# EAGLE design PWM v1.1 (EAGLE 6.1)
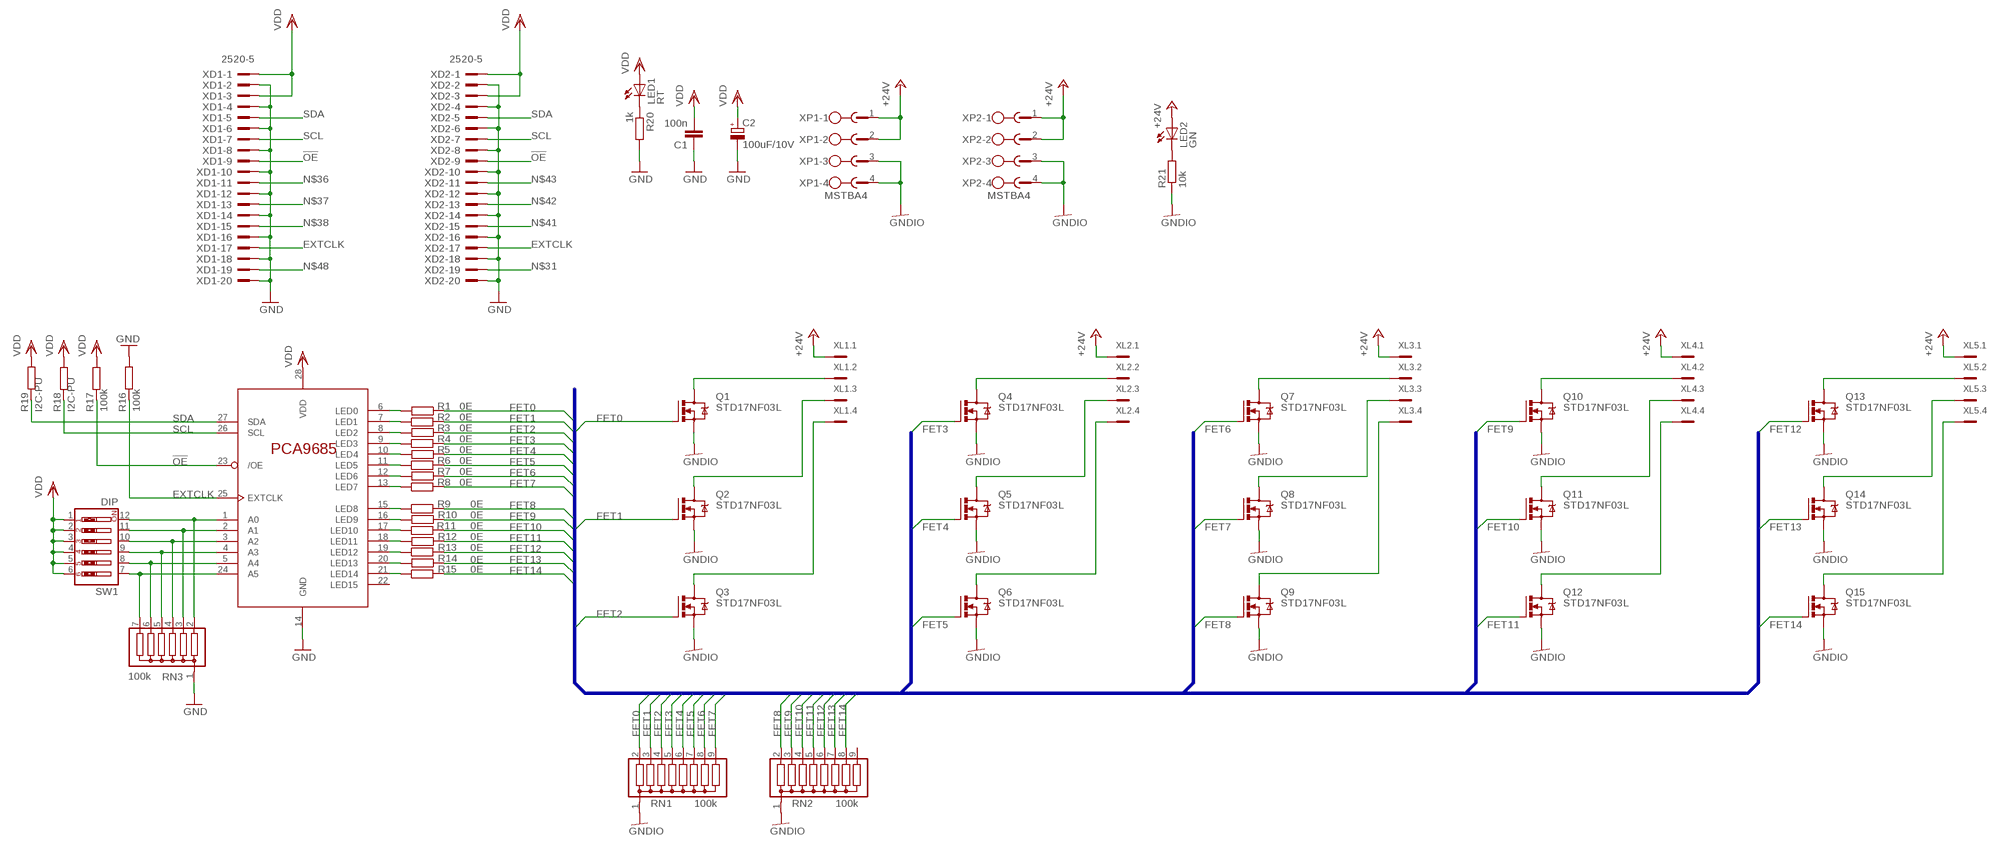
[diagram p0: schematic, sheet 1]

## Parts
C1  100n  C-EU025_050-035X075  [C025_050-035X075]
C2  100uF/10V  CPOL-EUE5-10.5  [E5-10,5]
IC1  PCA9685  [DIL28-6]
LED1  RT  LED3MM  [LED3MM]
LED2  GN  LED3MM  [LED3MM]
Q1  STD17NF03L  [TO251AA-V]
Q2  STD17NF03L  [TO251AA-V]
Q3  STD17NF03L  [TO251AA-V]
Q4  STD17NF03L  [TO251AA-V]
Q5  STD17NF03L  [TO251AA-V]
Q6  STD17NF03L  [TO251AA-V]
Q7  STD17NF03L  [TO251AA-V]
Q8  STD17NF03L  [TO251AA-V]
Q9  STD17NF03L  [TO251AA-V]
Q10  STD17NF03L  [TO251AA-V]
Q11  STD17NF03L  [TO251AA-V]
Q12  STD17NF03L  [TO251AA-V]
Q13  STD17NF03L  [TO251AA-V]
Q14  STD17NF03L  [TO251AA-V]
Q15  STD17NF03L  [TO251AA-V]
R1  0E  R-EU_0207/2V  [0207/2V]
R2  0E  R-EU_0207/2V  [0207/2V]
R3  0E  R-EU_0207/2V  [0207/2V]
R4  0E  R-EU_0207/2V  [0207/2V]
R5  0E  R-EU_0207/2V  [0207/2V]
R6  0E  R-EU_0207/2V  [0207/2V]
R7  0E  R-EU_0207/2V  [0207/2V]
R8  0E  R-EU_0207/2V  [0207/2V]
R9  0E  R-EU_0207/2V  [0207/2V]
R10  0E  R-EU_0207/2V  [0207/2V]
R11  0E  R-EU_0207/2V  [0207/2V]
R12  0E  R-EU_0207/2V  [0207/2V]
R13  0E  R-EU_0207/2V  [0207/2V]
R14  0E  R-EU_0207/2V  [0207/2V]
R15  0E  R-EU_0207/2V  [0207/2V]
R16  100k  R-EU_0207/2V  [0207/2V]
R17  100k  R-EU_0207/2V  [0207/2V]
R18  I2C-PU  R-EU_0207/2V  [0207/2V]
R19  I2C-PU  R-EU_0207/2V  [0207/2V]
R20  1k  R-EU_0207/2V  [0207/2V]
R21  10k  R-EU_0207/2V  [0207/2V]
RN1  100k  G08R  [SIL9]
RN2  100k  G08R  [SIL9]
RN3  100k  G06R  [SIL7]
SW1  DIP  SW_DIP-6  [EDG-06]
XD1  2520-5  [PAK100/2500-5-20]
XD2  2520-5  [PAK100/2500-5-20]
XL1  MC4  [MC4]
XL2  MC4  [MC4]
XL3  MC4  [MC4]
XL4  MC4  [MC4]
XL5  MC4  [MC4]
XP1  MSTBA4  [MSTBA4]
XP2  MSTBA4  [MSTBA4]

## Nets
!OE: IC1.23(/OE) R17.2 XD1.9 XD2.9
+24V: LED2.A XL1.1 XL2.1 XL3.1 XL4.1 XL5.1 XP1.1 XP1.2 XP2.1 XP2.2
EXTCLK: IC1.25(EXTCLK) R16.1 XD1.17 XD2.17
FET0: Q1.1(G) R1.1 RN1.9
FET1: Q2.1(G) R2.2 RN1.8
FET2: Q3.1(G) R3.1 RN1.7
FET3: Q4.1(G) R4.2 RN1.6
FET4: Q5.1(G) R5.1 RN1.5
FET5: Q6.1(G) R6.2 RN1.4
FET6: Q7.1(G) R7.1 RN1.3
FET7: Q8.1(G) R8.2 RN1.2
FET8: Q9.1(G) R9.2 RN2.2
FET9: Q10.1(G) R10.1 RN2.3
FET10: Q11.1(G) R11.2 RN2.4
FET11: Q12.1(G) R12.1 RN2.5
FET12: Q13.1(G) R13.2 RN2.6
FET13: Q14.1(G) R14.1 RN2.7
FET14: Q15.1(G) R15.2 RN2.8
GND: C1.1 C2.- IC1.14(GND) R16.2 R20.2 RN3.1 XD1.2 XD1.4 XD1.6 XD1.8 XD1.10 XD1.12 XD1.14 XD1.16 XD1.18 XD1.20 XD2.2 XD2.4 XD2.6 XD2.8 XD2.10 XD2.12 XD2.14 XD2.16 XD2.18 XD2.20
GNDIO: Q1.3(S) Q2.3(S) Q3.3(S) Q4.3(S) Q5.3(S) Q6.3(S) Q7.3(S) Q8.3(S) Q9.3(S) Q10.3(S) Q11.3(S) Q12.3(S) Q13.3(S) Q14.3(S) Q15.3(S) R21.1 RN1.1 RN2.1 XP1.3 XP1.4 XP2.3 XP2.4
N$1: Q1.2(D) XL1.2
N$2: Q2.2(D) XL1.3
N$3: Q3.2(D) XL1.4
N$4: Q6.2(D) XL2.4
N$5: Q4.2(D) XL2.2
N$6: Q5.2(D) XL2.3
N$7: Q8.2(D) XL3.3
N$8: Q7.2(D) XL3.2
N$9: Q9.2(D) XL3.4
N$10: Q10.2(D) XL4.2
N$11: Q11.2(D) XL4.3
N$12: Q12.2(D) XL4.4
N$13: Q13.2(D) XL5.2
N$14: Q14.2(D) XL5.3
N$15: Q15.2(D) XL5.4
N$16: IC1.6(LED0) R1.2
N$17: IC1.7(LED1) R2.1
N$18: IC1.8(LED2) R3.2
N$19: IC1.9(LED3) R4.1
N$20: IC1.10(LED4) R5.2
N$21: IC1.11(LED5) R6.1
N$22: IC1.12(LED6) R7.2
N$23: IC1.13(LED7) R8.1
N$24: IC1.15(LED8) R9.1
N$25: IC1.16(LED9) R10.2
N$26: IC1.17(LED10) R11.1
N$27: IC1.18(LED11) R12.2
N$28: IC1.19(LED12) R13.1
N$29: IC1.20(LED13) R14.2
N$30: IC1.21(LED14) R15.1
N$31: XD2.19
N$32: IC1.1(A0) RN3.2 SW1.12
N$33: IC1.2(A1) RN3.3 SW1.11
N$34: IC1.3(A2) RN3.4 SW1.10
N$36: XD1.11
N$37: XD1.13
N$38: XD1.15
N$39: IC1.4(A3) RN3.5 SW1.9
N$40: IC1.5(A4) RN3.6 SW1.8
N$41: XD2.15
N$42: XD2.13
N$43: XD2.11
N$45: IC1.24(A5) RN3.7 SW1.7
N$46: LED1.K(C) R20.1
N$47: LED2.K(C) R21.2
N$48: XD1.19
SCL: IC1.26(SCL) R18.2 XD1.7 XD2.7
SDA: IC1.27(SDA) R19.1 XD1.5 XD2.5
VDD: C1.2 C2.+ IC1.28(VDD) LED1.A R17.1 R18.1 R19.2 SW1.1 SW1.2 SW1.3 SW1.4 SW1.5 SW1.6 XD1.1 XD1.3 XD2.1 XD2.3
Unconnected: IC1.22(LED15) RN2.9

## Buses
FET[0..14]

## Library data of the parts
C1 = rcl:C-EU: CAPACITOR, European symbol
C2 = rcl:CPOL-EU: POLARIZED CAPACITOR, European symbol
IC1 = i2c-led-controller:PCA9685
LED1 LED2 = led:LED: LED OSRAM: - CHIPLED LG R971, LG N971, LY N971, LG Q971, LY Q971, LO R971, LY R971 LH N974, LH R974 LS Q976, LO Q976, LY Q976 LO Q996 - Hyper CHIPLED LW Q18S LB Q993, LB Q99A, LB R99A - SideLED LS A670, LO A670, LY A670, LG A670, LP A670 LB A673, LV A673, LT A673, LW A673 LH A674 LY A675 LS A676, LA A676, LO A676, LY A676, LW A676 LS A679, LY A679, LG A679 - Hyper Micro SIDELED® LS Y876, LA Y876, LO Y876, LY Y876 LT Y87S - SmartLED LW L88C, LW L88S LB L89C, LB L89S, LG L890 LS L89K, LO L89K, LY L89K LS L896, LA L896, LO L896, LY L896 - TOPLED LS T670, LO T670, LY T670, LG T670, LP T670 LSG T670, LSP T670, LSY T670, LOP T670, LYG T670 LG T671, LOG T671, LSG T671 LB T673, LV T673, LT T673, LW T673 LH T674 LS T676, LA T676, LO T676, LY T676, LB T676, LH T676, LSB T676, LW T676 LB T67C, LV T67C, LT T67C, LS T67K, LO T67K, LY T67K, LW E67C LS E67B, LA E67B, LO E67B, LY E67B, LB E67C, LV E67C, LT E67C LW T67C LS T679, LY T679, LG T679 LS T770, LO T770, LY T770, LG T770, LP T770 LB T773, LV T773, LT T773, LW T773 LH T774 LS E675, LA E675, LY E675, LS T675 LS T776, LA T776, LO T776, LY T776, LB T776 LHGB T686 LT T68C, LB T68C - Hyper Mini TOPLED® LB M676 - Mini TOPLED Santana® LG M470 LS M47K, LO M47K, LY M47K Source: http://www.osram.convergy.de LUXEON: - LUMILED® LXK2-PW12-R00, LXK2-PW12-S00, LXK2-PW14-U00, LXK2-PW14-V00 LXK2-PM12-R00, LXK2-PM12-S00, LXK2-PM14-U00 LXK2-PE12-Q00, LXK2-PE12-R00, LXK2-PE12-S00, LXK2-PE14-T00, LXK2-PE14-U00 LXK2-PB12-K00, LXK2-PB12-L00, LXK2-PB12-M00, LXK2-PB14-N00, LXK2-PB14-P00, LXK2-PB14-Q00 LXK2-PR12-L00, LXK2-PR12-M00, LXK2-PR14-Q00, LXK2-PR14-R00 LXK2-PD12-Q00, LXK2-PD12-R00, LXK2-PD12-S00 LXK2-PH12-R00, LXK2-PH12-S00 LXK2-PL12-P00, LXK2-PL12-Q00, LXK2-PL12-R00 Source: www.luxeon.com KINGBRIGHT: KA-3528ASYC Source: www.kingbright.com
Q1-Q15 = STD17NF03L:STD17NF03L: STD17NF03L http://www.st.com/internet/com/TECHNICAL_RESOURCES/TECHNICAL_LITERATURE/DATASHEET/CD00002145.pdf
R1-R21 = resistor:R-EU_: RESISTOR, European symbol
RN1 RN2 = resistor-sil:G08R: SIL RESISTOR; OC_FARNELL: unknown; OC_NEWARK: unknown
RN3 = resistor-sil:G06R: SIL RESISTOR; OC_FARNELL: unknown; OC_NEWARK: unknown
SW1 = special:SW_DIP-6: DIP SWITCH
XD1 XD2 = con-3m:2520-: 3M (TM) Pak 100 4-Wall Header Source: 3M; MPN: D2520-5002-AR; OC_FARNELL: unknown; OC_NEWARK: 12P7058
XL1-XL5 = con-phoenix-381_l_1:MC4: Mini-Combicon 3.81mm horizontal 4-polig MC 1,5/4-G-3,81 Artikel-Nr. 1803293
XP1 XP2 = con-phoenix-508:MSTBA4: PHOENIX; MF: FARNELL; MPN: 1757268; OC_FARNELL: 3705195; OC_NEWARK: 71C4163

## Net classes
0 default: width 0.254 mm

## Board
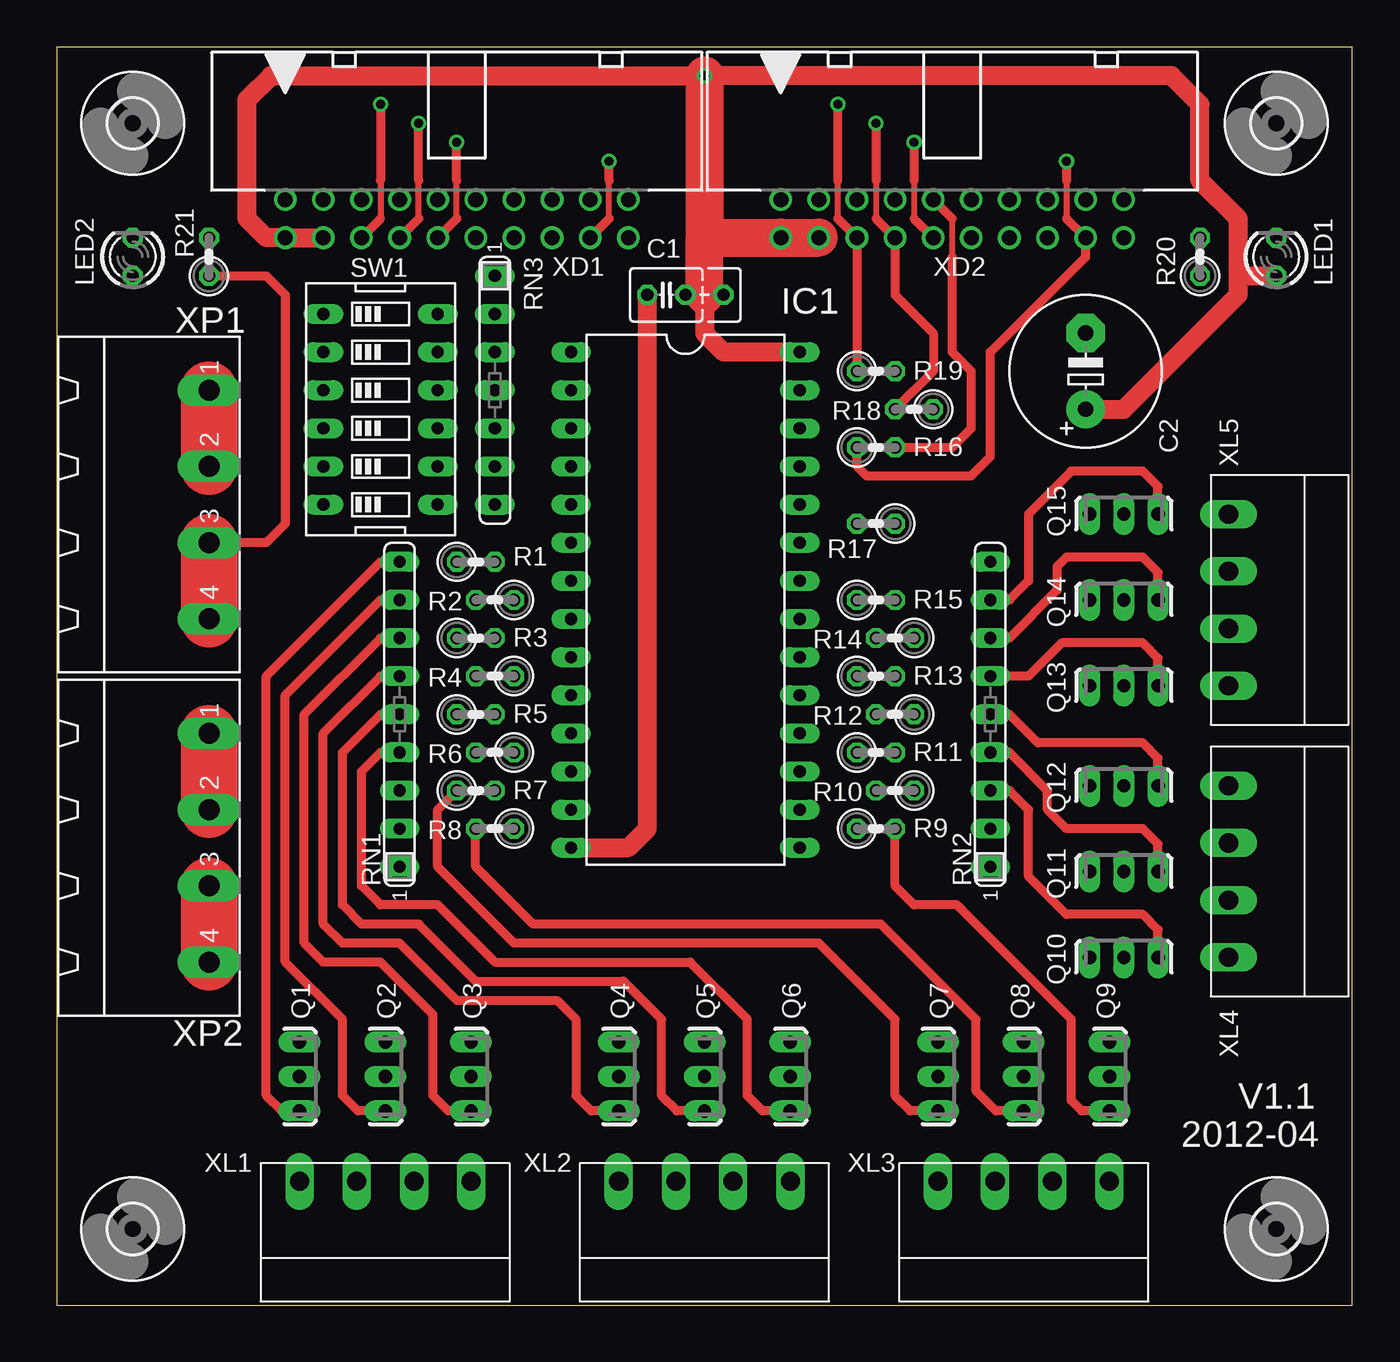
[diagram p1: board, top side]
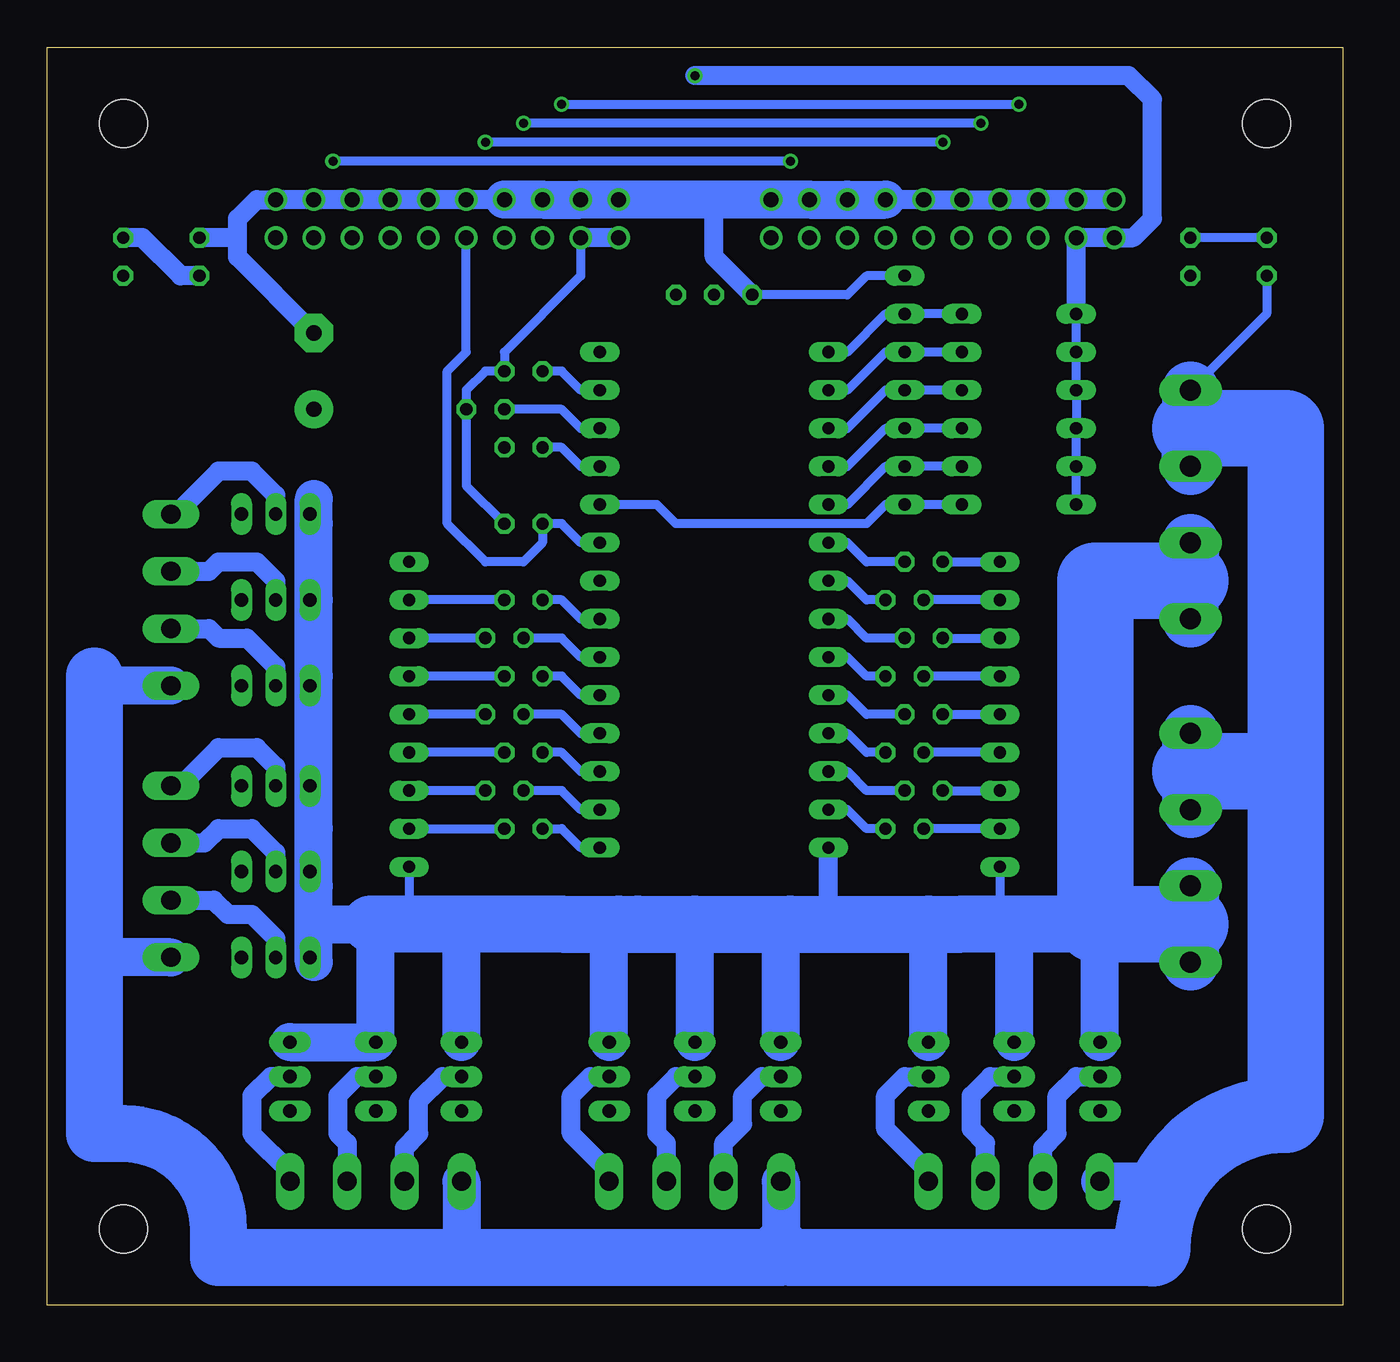
[diagram p2: board, bottom side, seen from below]

Size 86.35 x 83.81 mm. Coordinates in mm from the lower left corner, seen from the top.
Outline: 0,0 86.35,0 86.35,83.81 0,83.81 0,0
Copper layers (1*16): Top 0.035mm / dielectric 1.6mm / Bottom 0.035mm
Design rules: minimum track width 8mil, minimum drill 16mil, track to track 8mil, track to pad 10mil, pad to pad 10mil, via to via 8mil, smd to smd 8mil, copper to edge 40mil, drill to drill 8mil, minimum pad ring 10mil, minimum via ring 8mil, stop-mask expansion 4mil, vias tented up to drill 0mil, thermal gap 10mil

### Footprints (pad centres in the part's own frame; a part is rotated, then mirrored left to right if it is on the bottom)
C025_050-035X075 = drill 0.813 octagon: 1 -1.27,0; 2 1.27,0; 3 3.81,0
E5-10,5 = drill 1.016 pad 2.54: + -2.54,0 | drill 1.016 pad 2.54 octagon: - 2.54,0
DIL28-6 = drill 0.813 long: 1 -15.24,-7.62; 2 -12.7,-7.62; 3 -10.16,-7.62; 4 -7.62,-7.62; 5 -5.08,-7.62; 6 -2.54,-7.62; 7 0,-7.62; 8 2.54,-7.62; 9 5.08,-7.62; 10 7.62,-7.62; 11 10.16,-7.62; 12 12.7,-7.62; 13 15.24,-7.62; 14 17.78,-7.62; 15 17.78,7.62; 16 15.24,7.62; 17 12.7,7.62; 18 10.16,7.62; 19 7.62,7.62; 20 5.08,7.62; 21 2.54,7.62; 22 0,7.62; 23 -2.54,7.62; 24 -5.08,7.62; 25 -7.62,7.62; 26 -10.16,7.62; 27 -12.7,7.62; 28 -15.24,7.62
LED3MM = drill 0.813 octagon: A -1.27,0; K 1.27,0
TO251AA-V = drill 0.889 long: 1 -2.286,0; 2 0,0; 3 2.286,0
0207/2V = drill 0.813 octagon: 1 -1.27,0; 2 1.27,0
SIL9 = drill 0.813 long: 1 -10.16,0; 2 -7.62,0; 3 -5.08,0; 4 -2.54,0; 5 0,0; 6 2.54,0; 7 5.08,0; 8 7.62,0; 9 10.16,0
SIL7 = drill 0.813 long: 1 -7.62,0; 2 -5.08,0; 3 -2.54,0; 4 0,0; 5 2.54,0; 6 5.08,0; 7 7.62,0
EDG-06 = drill 0.813 long: 1 -6.35,-3.81; 2 -3.81,-3.81; 3 -1.27,-3.81; 4 1.27,-3.81; 5 3.81,-3.81; 6 6.35,-3.81; 7 6.35,3.81; 8 3.81,3.81; 9 1.27,3.81; 10 -1.27,3.81; 11 -3.81,3.81; 12 -6.35,3.81
3,2 = hole 3.2: 0,0
PAK100/2500-5-20 = drill 1 pad 1.422: 1 -11.43,-1.27; 2 -11.43,1.27; 3 -8.89,-1.27; 4 -8.89,1.27; 5 -6.35,-1.27; 6 -6.35,1.27; 7 -3.81,-1.27; 8 -3.81,1.27; 9 -1.27,-1.27; 10 -1.27,1.27; 11 1.27,-1.27; 12 1.27,1.27; 13 3.81,-1.27; 14 3.81,1.27; 15 6.35,-1.27; 16 6.35,1.27; 17 8.89,-1.27; 18 8.89,1.27; 19 11.43,-1.27; 20 11.43,1.27
MC4 = drill 1.27 long: 1 -5.715,0; 2 -1.905,0; 3 1.905,0; 4 5.715,0
MSTBA4 = drill 1.397 long: 1 -7.62,5.08; 2 -2.54,5.08; 3 2.54,5.08; 4 7.62,5.08

### Placement (x,y rotation side)
C1  40.64,67.31 0 top
C2  68.58,62.23 90 top
IC1  41.91,48.26 270 top
LED1  81.28,69.85 90 top
LED2  5.08,69.85 90 top
Q1  16.19,15.24 90 top
Q2  21.91,15.24 90 top
Q3  27.62,15.24 90 top
Q4  37.47,15.24 90 top
Q5  43.18,15.24 90 top
Q6  48.9,15.24 90 top
Q7  58.74,15.24 90 top
Q8  64.45,15.24 90 top
Q9  70.17,15.24 90 top
Q10  71.12,23.18 180 top
Q11  71.12,28.89 180 top
Q12  71.12,34.61 180 top
Q13  71.12,41.27 180 top
Q14  71.12,46.99 180 top
Q15  71.12,52.7 180 top
R1  27.94,49.53 0 top
R2  29.21,46.99 180 top
R3  27.94,44.45 0 top
R4  29.21,41.91 180 top
R5  27.94,39.37 0 top
R6  29.21,36.83 180 top
R7  27.94,34.29 0 top
R8  29.21,31.75 180 top
R9  54.61,31.75 0 top
R10  55.88,34.29 180 top
R11  54.61,36.83 0 top
R12  55.88,39.37 180 top
R13  54.61,41.91 0 top
R14  55.88,44.45 180 top
R15  54.61,46.99 0 top
R16  54.61,57.15 0 top
R17  54.61,52.07 180 top
R18  57.15,59.69 180 top
R19  54.61,62.23 0 top
R20  76.2,69.85 90 top
R21  10.16,69.85 90 top
RN1  22.86,39.37 90 top
RN2  62.23,39.37 90 top
RN3  29.21,60.96 270 top
SW1  21.59,59.69 270 top
U$1  [3,2]  5.08,78.74 0 top
U$2  [3,2]  5.08,5.08 0 top
U$3  [3,2]  81.28,5.08 0 top
U$4  [3,2]  81.28,78.74 0 top
XD1  26.67,72.39 0 top
XD2  59.69,72.39 0 top
XL1  21.91,8.26 0 top
XL2  43.18,8.26 0 top
XL3  64.45,8.26 0 top
XL4  78.11,28.89 90 top
XL5  78.11,46.99 90 top
XP1  5.08,53.34 270 top
XP2  5.08,30.48 270 top

### Tracks (layer width: path | path; a pad name or v marks a point on that pad's centre or on a via)
!OE  (via drill 0.6)
  Top 0.406: 26.67,72.39 26.67,74.93 | 57.15,74.93 57.15,72.39
  Top 0.61: XD1.9 26.67,72.39 | 26.67,74.93 v26.67,77.47 | v57.15,77.47 57.15,74.93 | 57.15,72.39 XD2.9
  Bottom 0.61: IC1.23 50.8,50.8 52.07,52.07 R17.2 53.34,50.8 54.61,49.53 57.15,49.53 59.69,52.07 59.69,62.23 58.42,63.5 XD2.9 | v26.67,77.47 v57.15,77.47
+24V
  Top 3.81: XP1.1 XP1.2 | XP2.1 XP2.2
  Bottom 0.61: LED2.A 5.08,66.04 XP1.1
  Bottom 2.54: 58.42,2.54 58.74,2.86 58.42,3.17 | XL3.1 58.74,3.17 | XL2.1 37.47,3.81 37.47,3.17 | XL5.1 83.19,41.27 83.19,41.91 | XL4.1 83.19,23.18 | XL1.1 12.06,8.26 | 12.06,8.26 11.43,8.89 | 12.7,3.17 12.7,3.81 12.06,4.45 12.06,8.26
  Bottom 3.81: XP1.1 10.16,58.42 XP1.2 | XP2.1 10.16,35.56 XP2.2 | 37.47,3.17 58.42,3.17 58.74,3.17 74.93,3.17 74.93,5.08 arc-90 81.28,11.43 83.19,11.43 83.19,23.18 83.19,41.91 | 12.7,3.17 36.83,3.17 37.47,3.81
  Bottom 5.08: 10.16,58.42 3.81,58.42 3.81,35.56 | 3.81,35.56 3.81,12.7 arc-90 12.7,3.81 | 10.16,35.56 3.81,35.56
EXTCLK  (via drill 0.6)
  Top 0.406: 36.83,72.39 36.83,74.93 | 67.31,74.93 67.31,72.39
  Top 0.61: R16.1 53.34,55.88 53.98,55.24 60.96,55.24 62.23,56.52 62.23,63.5 68.58,69.85 XD2.17 67.31,72.39 | 36.83,74.93 v36.83,76.2 | XD1.17 36.83,72.39 | v67.31,76.2 67.31,74.93
  Bottom 0.61: IC1.25 50.8,55.88 52.07,57.15 R16.1 | v36.83,76.2 v67.31,76.2
FET0
  Top 0.61: RN1.9 21.59,49.53 13.97,41.91 13.97,13.97 14.99,12.95 Q1.1
  Bottom 0.61: R1.1 RN1.9
FET1
  Top 0.61: RN1.8 21.59,46.99 15.24,40.64 15.24,22.86 19.05,19.05 19.05,13.97 20.07,12.95 Q2.1
  Bottom 0.61: RN1.8 R2.2
FET2
  Top 0.61: RN1.7 21.59,44.45 16.51,39.37 16.51,24.13 17.78,22.86 21.59,22.86 25.08,19.37 25.08,13.97 26.1,12.95 Q3.1
  Bottom 0.61: R3.1 RN1.7
FET3
  Top 0.61: Q4.1 35.62,12.95 34.61,13.97 34.61,19.05 33.34,20.32 26.67,20.32 22.86,24.13 19.05,24.13 17.78,25.4 17.78,38.1 21.59,41.91 RN1.6
  Bottom 0.61: RN1.6 R4.2
FET4
  Top 0.61: RN1.5 21.59,39.37 19.05,36.83 19.05,26.67 20.32,25.4 24.13,25.4 27.94,21.59 37.78,21.59 40.32,19.05 40.32,13.97 41.34,12.95 Q5.1
  Bottom 0.61: R5.1 RN1.5
FET5
  Top 0.61: RN1.4 21.59,36.83 20.32,35.56 20.32,27.94 21.59,26.67 25.4,26.67 29.21,22.86 42.23,22.86 46.04,19.05 46.04,13.97 47.05,12.95 Q6.1
  Bottom 0.61: RN1.4 R6.2
FET6
  Top 0.61: R7.1 25.4,33.02 25.4,29.21 30.48,24.13 50.8,24.13 55.88,19.05 55.88,13.97 56.9,12.95 Q7.1
  Bottom 0.61: R7.1 RN1.3
FET7
  Top 0.61: R8.2 27.94,29.21 31.75,25.4 54.93,25.4 61.28,19.05 61.28,14.29 62.61,12.95 Q8.1
  Bottom 0.61: RN1.2 R8.2
FET8
  Top 0.61: R9.2 55.88,27.94 57.15,26.67 60.01,26.67 67.63,19.05 67.63,13.65 68.33,12.95 Q9.1
  Bottom 0.61: RN2.2 R9.2
FET9
  Top 0.61: Q10.1 73.41,25.02 72.39,26.04 67.31,26.04 64.77,28.57 64.77,33.02 63.5,34.29 RN2.3
  Bottom 0.61: R10.1 RN2.3
FET10
  Top 0.61: Q11.1 73.41,30.73 72.39,31.75 67.31,31.75 66.04,33.02 66.04,34.29 63.5,36.83 RN2.4
  Bottom 0.61: R11.2 RN2.4
FET11
  Top 0.61: Q12.1 73.41,36.45 72.39,37.47 65.41,37.47 63.5,39.37 RN2.5
  Bottom 0.61: R12.1 RN2.5
FET12
  Top 0.61: Q13.1 73.41,43.12 72.39,44.13 66.99,44.13 64.77,41.91 RN2.6
  Bottom 0.61: R13.2 RN2.6
FET13
  Top 0.61: Q14.1 73.41,48.83 72.39,49.85 67.31,49.85 66.67,49.21 66.67,47.62 63.5,44.45 RN2.7
  Bottom 0.61: R14.1 RN2.7
FET14
  Top 0.61: Q15.1 73.41,54.55 72.39,55.56 67.63,55.56 64.77,52.7 64.77,48.26 63.5,46.99 RN2.8
  Bottom 0.61: R15.2 RN2.8
GND
  Top 0.406: 59.69,69.85 59.69,72.39
  Top 0.61: R16.2 59.69,57.15 60.96,58.42 60.96,62.23 59.69,63.5 59.69,69.85 | 59.69,72.39 XD2.10
  Top 1.27: IC1.14 38.1,30.48 39.37,31.75 C1.1
  Bottom 0.61: RN3.1 31.75,68.58 33.02,67.31 C1.1
  Bottom 1.27: XD1.14 XD1.12 XD1.10 XD1.8 XD1.6 XD1.4 XD1.2 | XD2.8 XD2.10 XD2.12 XD2.14 XD2.16 XD2.18 XD2.20 72.39,73.66 73.66,72.39 73.66,71.12 | 73.66,71.12 R20.2 | C1.1 41.91,69.85 41.91,73.66 | C2.- 73.66,69.85 73.66,71.12 | 34.29,25.4 IC1.14
  Bottom 2.54: XD1.14 XD1.16 XD1.18 XD1.20 41.91,73.66 XD2.2 XD2.4 XD2.6 XD2.8
GNDIO
  Top 0.61: R21.1 13.97,68.58 15.24,67.31 15.24,52.07 13.97,50.8 XP1.3
  Top 3.81: XP1.3 XP1.4 | XP2.3 XP2.4
  Bottom 0.61: RN1.1 22.86,25.4 | RN2.1 62.23,25.4
  Bottom 1.27: 20.07,25.15 20.32,25.4 | 24.51,24.51 25.4,25.4 | 47.37,25.4 46.99,25.4 | Q12.3 68.83,31.75 68.58,31.75 | Q11.3 68.83,27.94 68.58,27.94 | Q13.3 68.83,41.91 68.58,41.91 | Q14.3 68.58,46.99 | Q15.3 68.83,52.07 68.58,52.07 | Q10.3 68.83,22.86 68.58,22.86
  Bottom 2.54: 68.58,25.4 68.58,27.94 68.58,31.75 68.58,41.91 68.58,46.99 68.58,52.07 68.58,53.72 | 68.58,22.86 68.58,25.4 | 68.58,25.4 64.77,25.4 | 52.45,25.34 52.13,25.34 52.07,25.4 | Q4.3 37.47,24.77 36.83,25.4 | Q1.3 16.19,25.08 16.51,25.4 | Q2.3 21.91,25.08 21.59,25.4 | Q3.3 27.62,25.4 | Q5.3 43.18,25.4 | Q6.3 48.9,24.77 48.26,25.4 | 63.5,25.4 64.45,25.4 Q8.3 Q9.3 | Q7.3 58.74,25.4
  Bottom 3.81: 16.51,25.4 20.32,25.4 21.59,25.4 22.86,25.4 25.4,25.4 27.62,25.4 36.83,25.4 43.18,25.4 46.99,25.4 48.26,25.4 52.07,25.4 58.74,25.4 62.23,25.4 64.45,25.4 64.77,25.4 | XP1.3 10.16,48.26 XP1.4 | XP2.3 10.16,25.4 XP2.4
  Bottom 5.08: 10.16,48.26 16.51,48.26 16.51,25.4 10.16,25.4
N$1
  Bottom 1.27: XL1.2 20,10.48 19.05,11.43 19.05,13.97 17.78,15.24 Q1.2
N$2
  Bottom 1.27: XL1.3 23.81,10.79 24.77,11.75 24.77,13.97 23.5,15.24 Q2.2
N$3
  Bottom 1.27: XL1.4 27.62,8.89 30.48,11.75 30.48,13.97 29.21,15.24 Q3.2
N$4
  Bottom 1.27: XL2.4 48.9,8.89 51.44,11.43 51.44,13.97 50.16,15.24 Q6.2
N$5
  Bottom 1.27: XL2.2 41.27,10.79 40.01,12.06 40.01,13.97 38.73,15.24 Q4.2
N$6
  Bottom 1.27: XL2.3 45.09,10.79 45.72,11.43 45.72,13.97 44.45,15.24 Q5.2
N$7
  Bottom 1.27: Q8.2 65.72,15.24 66.99,13.97 66.99,11.43 66.36,10.79 XL3.3
N$8
  Bottom 1.27: XL3.2 62.55,10.48 61.59,11.43 61.59,13.65 60.01,15.24 Q7.2 58.42,15.24
N$9
  Bottom 1.27: Q9.2 71.44,15.24 72.71,13.97 72.71,11.43 70.17,8.89 XL3.4
N$10
  Bottom 1.27: XL4.2 75.25,26.99 74.3,26.04 72.71,26.04 71.12,24.45 Q10.2 71.12,22.86
N$11
  Bottom 1.27: XL4.3 75.88,30.8 74.93,31.75 72.71,31.75 71.12,30.16 Q11.2
N$12
  Bottom 1.27: XL4.4 77.47,34.61 74.93,37.15 72.39,37.15 71.12,35.88 Q12.2
N$13
  Bottom 1.27: XL5.2 75.56,45.09 74.93,44.45 73.03,44.45 71.12,42.55 Q13.2
N$14
  Bottom 1.27: XL5.3 75.56,48.9 74.93,49.53 72.39,49.53 71.12,48.26 Q14.2
N$15
  Bottom 1.27: Q15.2 71.12,53.98 72.71,55.56 74.93,55.56 77.79,52.7 XL5.4
N$16
  Bottom 0.61: R1.2 31.75,49.53 33.02,50.8 IC1.6
N$17
  Bottom 0.61: R2.1 31.75,46.99 33.02,48.26 IC1.7
N$18
  Bottom 0.61: R3.2 31.75,44.45 33.02,45.72 IC1.8
N$19
  Bottom 0.61: R4.1 31.75,41.91 33.02,43.18 IC1.9
N$20
  Bottom 0.61: R5.2 31.75,39.37 33.02,40.64 IC1.10
N$21
  Bottom 0.61: R6.1 31.75,36.83 33.02,38.1 IC1.11
N$22
  Bottom 0.61: R7.2 31.75,34.29 33.02,35.56 IC1.12
N$23
  Bottom 0.61: R8.1 31.75,31.75 33.02,33.02 IC1.13
N$24
  Bottom 0.61: R9.1 52.07,31.75 50.8,30.48 IC1.15
N$25
  Bottom 0.61: IC1.16 50.8,33.02 52.07,34.29 R10.2
N$26
  Bottom 0.61: IC1.17 50.8,35.56 52.07,36.83 R11.1
N$27
  Bottom 0.61: IC1.18 50.8,38.1 52.07,39.37 R12.2
N$28
  Bottom 0.61: IC1.19 50.8,40.64 52.07,41.91 R13.1
N$29
  Bottom 0.61: IC1.20 50.8,43.18 52.07,44.45 R14.2
N$30
  Bottom 0.61: IC1.21 50.8,45.72 52.07,46.99 R15.1
N$32
  Bottom 0.61: SW1.12 RN3.2 30.48,66.04 33.02,63.5 IC1.1
N$33
  Bottom 0.61: SW1.11 RN3.3 30.48,63.5 33.02,60.96 IC1.2
N$34
  Bottom 0.61: SW1.10 RN3.4 30.48,60.96 33.02,58.42 IC1.3
N$39
  Bottom 0.61: SW1.9 RN3.5 30.48,58.42 33.02,55.88 IC1.4
N$40
  Bottom 0.61: SW1.8 RN3.6 30.48,55.88 33.02,53.34 IC1.5
N$45
  Bottom 0.61: SW1.7 RN3.7 30.48,53.34 31.75,52.07 44.45,52.07 45.72,53.34 IC1.24
N$46
  Bottom 1.27: R20.1 77.47,68.58 80.01,71.12 LED1.K
N$47
  Bottom 0.61: LED2.K R21.2
SCL  (via drill 0.6)
  Top 0.406: 24.13,72.39 24.13,74.93 | 54.61,74.93 54.61,72.39
  Top 0.61: XD1.7 24.13,72.39 | 24.13,74.93 v24.13,78.74 | v54.61,78.74 54.61,74.93 | 54.61,72.39 XD2.7 55.88,67.31 58.42,64.77 58.42,62.23 R18.2
  Bottom 0.61: v24.13,78.74 v54.61,78.74 | IC1.26 50.8,58.42 52.07,59.69 R18.2
SDA  (via drill 0.6)
  Top 0.406: 52.07,72.39 52.07,74.93 | 21.59,74.93 21.59,72.39
  Top 0.61: 52.07,72.39 XD2.5 R19.1 | 52.07,74.93 v52.07,80.01 | v21.59,80.01 21.59,74.93 | 21.59,72.39 XD1.5
  Bottom 0.61: IC1.27 50.8,60.96 52.07,62.23 R19.1 | v52.07,80.01 v21.59,80.01
VDD  (via drill 0.6)
  Top 1.27: 78.74,68.58 LED1.A | IC1.28 44.45,63.5 43.18,64.77 43.18,67.31 C1.2 | C2.+ 71.12,59.69 78.74,67.31 78.74,68.58 | 78.74,68.58 78.74,72.39 76.2,74.93 76.2,80.01 74.3,81.92 v43.18,81.92 14.29,81.92 12.7,80.33 12.7,72.39 13.97,71.12 XD1.1 XD1.3
  Top 2.54: v43.18,81.92 43.18,71.12 | 43.18,67.31 43.18,71.12 | 43.18,71.12 XD2.1 XD2.3
  Bottom 0.61: SW1.6 SW1.5 SW1.4 SW1.3 SW1.2 SW1.1 | XD2.3 50.8,68.58 55.88,63.5 R19.2 57.15,62.23 58.42,60.96 R18.1 58.42,54.61 R17.1
  Bottom 1.27: XD2.1 XD2.3 | v43.18,81.92 14.29,81.92 12.7,80.33 12.7,72.39 13.97,71.12 XD1.1 XD1.3 SW1.1

### Text on the board
tNames: V1.1 | 2012-04
tValues: +24V | +5V | +24V | B | G | GND | R | + | B | +24V | G | R | I2C PWM Power Board | + | GND | + | R | G | B | + | R | G | B | + | R | G | B
tDocu: OK